# Altium schematic sheet misc.SchDoc
size A4
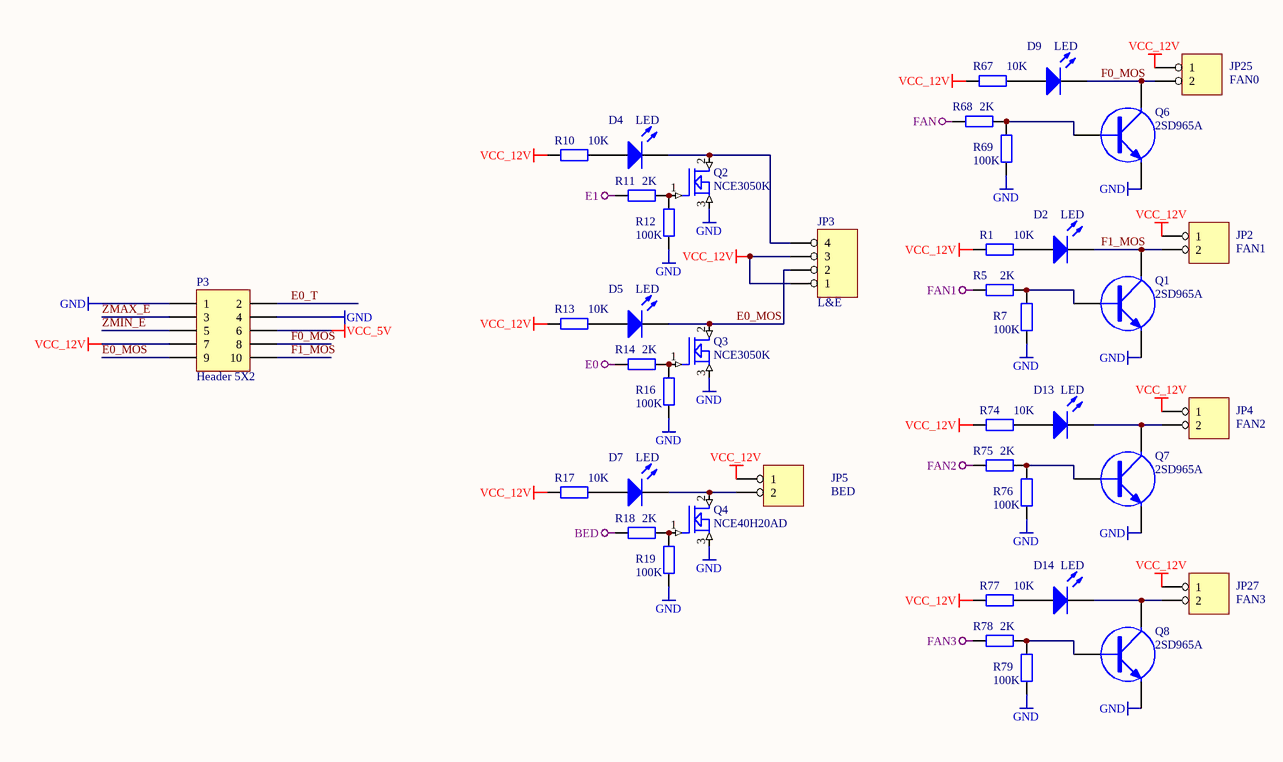
[diagram p0: misc.SchDoc]

## Parts
D2  LED  [LED-SMD-0805]
D4  LED  [LED-SMD-0805]
D5  LED  [LED-SMD-0805]
D7  LED  [LED-SMD-0805]
D9  LED  [LED-SMD-0805]
D13  LED  [LED-SMD-0805]
D14  LED  [LED-SMD-0805]
JP2  FAN1  [XH2.54-2P]
JP3  L&E  [KF127-4*5.0]
JP4  FAN2  [XH2.54-2P]
JP5  BED  [POWER JACK-2*5.0]
JP25  FAN0  [XH2.54-2P]
JP27  FAN3  [XH2.54-2P]
P3  Header 5X2  [HX30002-10A]
Q1  2SD965A  [SOT89-3357]
Q2  NCE3050K  [TO252]
Q3  NCE3050K  [TO252]
Q4  NCE40H20AD  [TO263-S]
Q6  2SD965A  [SOT89-3357]
Q7  2SD965A  [SOT89-3357]
Q8  2SD965A  [SOT89-3357]
R1  10K  [0603(R)]
R5  2K  [0603(R)]
R7  100K  [0603(R)]
R10  10K  [0603(R)]
R11  2K  [0603(R)]
R12  100K  [0603(R)]
R13  10K  [0603(R)]
R14  2K  [0603(R)]
R16  100K  [0603(R)]
R17  10K  [0603(R)]
R18  2K  [0603(R)]
R19  100K  [0603(R)]
R67  10K  [0603(R)]
R68  2K  [0603(R)]
R69  100K  [0603(R)]
R74  10K  [0603(R)]
R75  2K  [0603(R)]
R76  100K  [0603(R)]
R77  10K  [0603(R)]
R78  2K  [0603(R)]
R79  100K  [0603(R)]

## Nets
BED: R18.1
E0: R14.1
E1: R11.1
FAN: R68.1
FAN1: R5.1
FAN2: R75.1
FAN3: R78.1
GND: P3.1 P3.4 Q1.2(E) Q2.3(S) Q3.3(S) Q4.3(S) Q6.2(E) Q7.2(E) Q8.2(E) R7.1 R12.1 R16.1 R19.1 R69.1 R76.1 R79.1
VCC_5V: P3.6
VCC_12V: JP2.1 JP3.1 JP3.3 JP4.1 JP5.1 JP25.1 JP27.1 P3.7 R1.1 R10.1 R13.1 R17.1 R67.1 R74.1 R77.1
E0_MOS: D5.2(K) JP3.2 P3.9 Q3.2(D)
E0_T: P3.2
F0_MOS: D9.2(K) JP25.2 P3.8 Q6.3(C)
F1_MOS: D2.2(K) JP2.2 P3.10 Q1.3(C)
ZMAX_E: P3.3
ZMIN_E: P3.5
NetD2_1: D2.1(A) R1.2
NetD4_1: D4.1(A) R10.2
NetD4_2: D4.2(K) JP3.4 Q2.2(D)
NetD5_1: D5.1(A) R13.2
NetD7_1: D7.1(A) R17.2
NetD7_2: D7.2(K) JP5.2 Q4.2(D)
NetD9_1: D9.1(A) R67.2
NetD13_1: D13.1(A) R74.2
NetD13_2: D13.2(K) JP4.2 Q7.3(C)
NetD14_1: D14.1(A) R77.2
NetD14_2: D14.2(K) JP27.2 Q8.3(C)
NetQ1_1: Q1.1(B) R5.2 R7.2
NetQ2_1: Q2.1(G) R11.2 R12.2
NetQ3_1: Q3.1(G) R14.2 R16.2
NetQ4_1: Q4.1(G) R18.2 R19.2
NetQ6_1: Q6.1(B) R68.2 R69.2
NetQ7_1: Q7.1(B) R75.2 R76.2
NetQ8_1: Q8.1(B) R78.2 R79.2

## Library data of the parts
D2 D4 D5 D7 D9 D13 D14 = LED1: Typical RED GaAs LED; Published: 8-Jun-2000; LatestRevisionDate: 08-Jul-2005; LatestRevisionNote: Mech Layer 1 removed.; PackageReference: LED-1; Publisher: Altium Limited; PackageDescription: LED; 2 Leads
JP2 JP4 JP5 JP25 JP27 = HEADER 2
JP3 = 4 HEADER: 4 Pin Header
P3 = Header 5X2: Header, 5-Pin, Dual row; LatestRevisionDate: 17-Jul-2002; LatestRevisionNote: Re-released for DXP Platform.; Publisher: Altium Limited
Q1 Q6-Q8 = NPN: NPN Transistor
Q2-Q4 = NMOS
R1 R10 R13 R17 R67 R74 R77 = Res2: Resistor
R5 R7 R11 R12 R14 R16 R18 R19 R68 R69 R75 R76 R78 R79 = Res2: 1K; Published: 8-Jun-2000; LatestRevisionDate: 17-Jul-2002; LatestRevisionNote: Re-released for DXP Platform.; PackageReference: AXIAL-0.4; Publisher: Altium Limited; PackageDescription: Axial Device, Thru-Hole; 2 Leads; 0.4 in Pin Spacing; Value: 1K